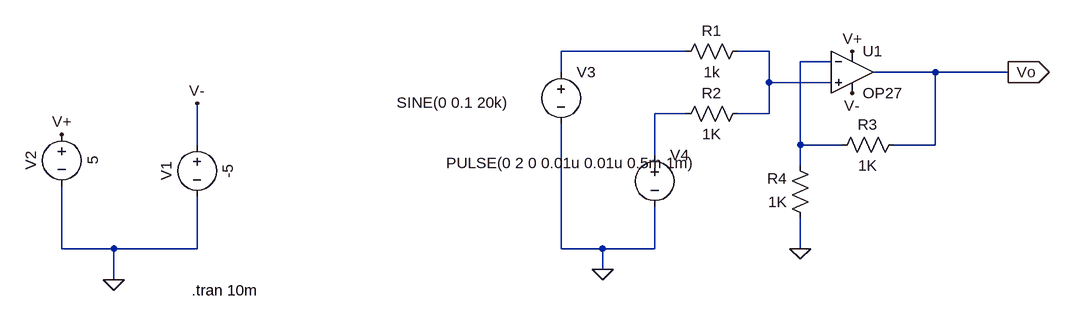
[diagram p0: schematic OP27.asc]
OP27.asc, the LTspice schematic file:
Version 4
SHEET 1 880 680
WIRE -96 32 -288 32
WIRE 32 32 -16 32
WIRE 128 48 80 48
WIRE -288 64 -288 32
WIRE 288 64 192 64
WIRE 400 64 288 64
WIRE 32 80 32 32
WIRE 128 80 32 80
WIRE -96 128 -144 128
WIRE 32 128 32 80
WIRE 32 128 -16 128
WIRE -848 176 -848 112
WIRE 80 176 80 48
WIRE 144 176 80 176
WIRE 288 176 288 64
WIRE 288 176 224 176
WIRE -144 192 -144 128
WIRE 80 208 80 176
WIRE -1056 336 -1056 240
WIRE -976 336 -1056 336
WIRE -848 336 -848 256
WIRE -848 336 -976 336
WIRE -288 336 -288 144
WIRE -224 336 -288 336
WIRE -144 336 -144 272
WIRE -144 336 -224 336
WIRE 80 336 80 288
WIRE -224 368 -224 336
WIRE -976 384 -976 336
FLAG 80 336 0
FLAG -1056 160 V+
FLAG -848 112 V-
FLAG 160 96 V-
FLAG 160 32 V+
FLAG 400 64 Vo
IOPIN 400 64 Out
FLAG -224 368 0
FLAG -976 384 0
SYMBOL OpAmps\\OP27 160 0 R0
SYMATTR InstName U1
SYMBOL res 0 16 R90
WINDOW 0 0 56 VBottom 2
WINDOW 3 32 56 VTop 2
SYMATTR InstName R1
SYMATTR Value 1k
SYMBOL res 0 112 R90
WINDOW 0 0 56 VBottom 2
WINDOW 3 32 56 VTop 2
SYMATTR InstName R2
SYMATTR Value 1K
SYMBOL res 96 304 R180
WINDOW 0 36 76 Left 2
WINDOW 3 36 40 Left 2
SYMATTR InstName R4
SYMATTR Value 1K
SYMBOL voltage -848 160 R0
WINDOW 0 -32 56 VBottom 2
WINDOW 3 32 56 VTop 2
WINDOW 123 0 0 Left 0
WINDOW 39 0 0 Left 0
SYMATTR InstName V1
SYMATTR Value -5
SYMBOL voltage -1056 144 R0
WINDOW 0 -32 56 VBottom 2
WINDOW 3 32 56 VTop 2
WINDOW 123 0 0 Left 0
WINDOW 39 0 0 Left 0
SYMATTR InstName V2
SYMATTR Value 5
SYMBOL voltage -288 48 R0
WINDOW 123 0 0 Left 0
WINDOW 39 0 0 Left 0
WINDOW 3 -253 63 Left 2
SYMATTR Value SINE(0 0.1 20k)
SYMATTR InstName V3
SYMBOL voltage -144 176 R0
WINDOW 123 0 0 Left 0
WINDOW 39 0 0 Left 0
WINDOW 3 -321 28 Left 2
SYMATTR Value PULSE(0 2 0 0.01u 0.01u 0.5m 1m)
SYMATTR InstName V4
SYMBOL res 240 160 R90
WINDOW 0 0 56 VBottom 2
WINDOW 3 32 56 VTop 2
SYMATTR InstName R3
SYMATTR Value 1K
TEXT -856 400 Left 2 !.tran 10m

The netlist it stands for:
* OP27.asc
XU1 N002 N003 V+ V- Vo OP27  ; pins In+ In- V+ V- OUT
R1 N002 N001 1k
R2 N002 N004 1K
R4 0 N003 1K
V1 V- 0 -5
V2 V+ 0 5
V3 N001 0 SINE(0 0.1 20k)
V4 N004 0 PULSE(0 2 0 0.01u 0.01u 0.5m 1m)
R3 Vo N003 1K
.tran 10m
.lib ADI.lib
.backanno
.end